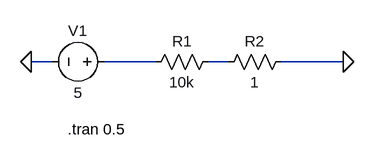
[diagram p0: schematic simple_highR.asc]
simple_highR.asc, the LTspice schematic file:
Version 4
SHEET 1 880 680
WIRE 0 256 -32 256
WIRE 160 256 80 256
WIRE 272 256 240 256
WIRE 448 256 352 256
FLAG 448 256 0
FLAG -32 256 0
SYMBOL voltage 96 256 R90
WINDOW 0 -32 56 VBottom 2
WINDOW 3 32 56 VTop 2
SYMATTR InstName V1
SYMATTR Value 5
SYMATTR SpiceLine Rser=0.0
SYMBOL Res 256 240 R90
WINDOW 0 0 56 VBottom 2
WINDOW 3 32 56 VTop 2
SYMATTR InstName R1
SYMATTR Value 10k
SYMBOL Res 368 240 R90
WINDOW 0 0 56 VBottom 2
WINDOW 3 32 56 VTop 2
SYMATTR InstName R2
SYMATTR Value 1
TEXT 24 360 Left 2 !.tran 0.5

The netlist it stands for:
* simple_highR.asc
V1 N001 0 5 Rser=0.0
R1 N002 N001 10k
R2 0 N002 1
.tran 0.5
.backanno
.end